# EAGLE design led_board_RGB-3hole (EAGLE 8.3.1)
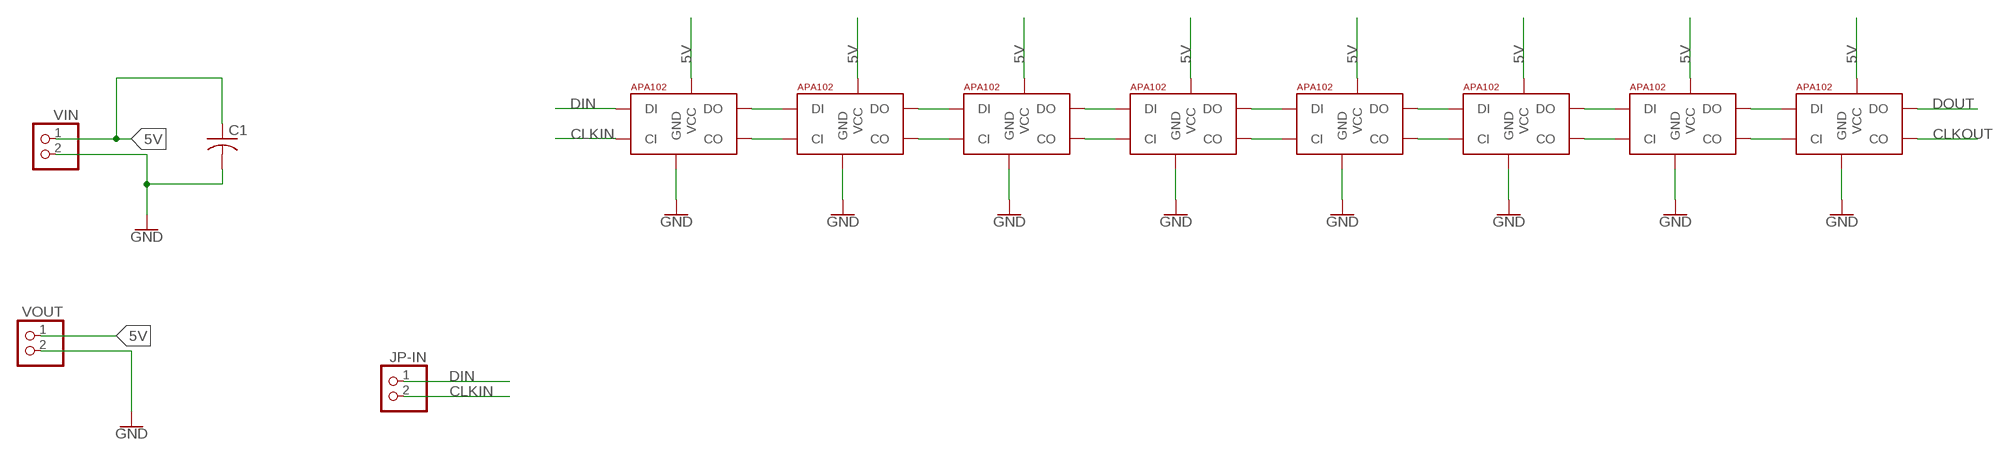
[diagram p0: schematic, sheet 1]

## Parts
C1  C-US025-030X050  [C025-030X050]
ED4  APA1025050  [APA102_5050]
JP-IN  PINHD-1X2  [1X02]
LED0  APA1025050  [APA102_5050]
LED1  APA1025050  [APA102_5050]
LED2  APA1025050  [APA102_5050]
LED3  APA1025050  [APA102_5050]
LED5  APA1025050  [APA102_5050]
LED6  APA1025050  [APA102_5050]
LED7  APA1025050  [APA102_5050]
VIN  PINHD-1X2  [1X02]
VOUT  PINHD-1X2  [1X02]

## Nets
5V: C1.1 ED4.1(VCC) LED0.1(VCC) LED1.1(VCC) LED2.1(VCC) LED3.1(VCC) LED5.1(VCC) LED6.1(VCC) LED7.1(VCC) VIN.1 VOUT.1
CLKIN: JP-IN.2 LED0.5(CI)
CLKOUT: LED7.2(CO)
DIN: JP-IN.1 LED0.4(DI)
DOUT: LED7.3(DO)
GND: C1.2 ED4.6(GND) LED0.6(GND) LED1.6(GND) LED2.6(GND) LED3.6(GND) LED5.6(GND) LED6.6(GND) LED7.6(GND) VIN.2 VOUT.2
N$9: LED0.3(DO) LED1.4(DI)
N$10: LED0.2(CO) LED1.5(CI)
N$11: LED1.3(DO) LED2.4(DI)
N$12: LED1.2(CO) LED2.5(CI)
N$13: LED2.3(DO) LED3.4(DI)
N$14: LED2.2(CO) LED3.5(CI)
N$15: ED4.4(DI) LED3.3(DO)
N$16: ED4.5(CI) LED3.2(CO)
N$17: ED4.3(DO) LED5.4(DI)
N$18: ED4.2(CO) LED5.5(CI)
N$19: LED5.3(DO) LED6.4(DI)
N$20: LED5.2(CO) LED6.5(CI)
N$21: LED6.3(DO) LED7.4(DI)
N$22: LED6.2(CO) LED7.5(CI)

## Library data of the parts
C1 = adafruit:C-US: CAPACITOR, American symbol
ED4 LED0 LED1-LED3 LED5-LED7 = jos-ph:APA102: APA102C 5050 RGB LED -- Adafruit DotStar Single LED Pixel Product Page: https://www.adafruit.com/products/2343 Datasheet: https://cdn-shop.adafruit.com/product-files/2343/APA102C.pdf
JP-IN VIN VOUT = pinhead:PINHD-1X2: PIN HEADER

## Board
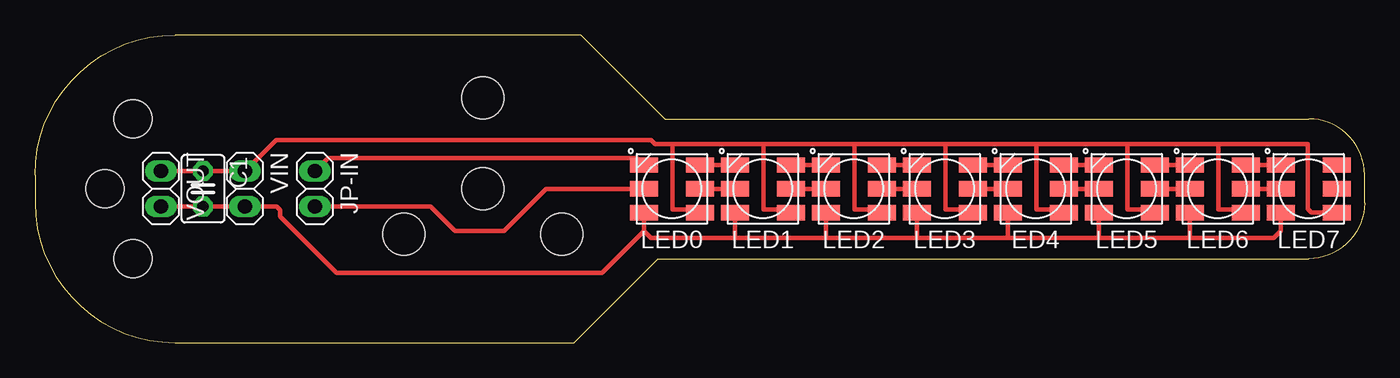
[diagram p1: board, top side]

Size 95 x 22 mm. Coordinates in mm from the lower left corner, seen from the top.
Outline: 10,0 38.5,0 44,5.5 44.5,6 45,6 91,6 arc90 95,10 95,12 arc90 91,16 45.5,16 45,16 44.5,16.5 39,22 10,22 arc90 0,12 0,10 arc90 10,0
Copper layers (1*16): Top 0.035mm / dielectric 1.5mm / Bottom 0.035mm
Design rules "OthermillDRC_1_64_v2": minimum track width 16mil, minimum drill 31mil, track to track 0.39878125mm, track to pad 0.39878125mm, pad to pad 0.39878125mm, via to via 0.39878125mm, smd to smd 0mil, copper to edge 0mil, drill to drill 1mil, minimum pad ring 0mil, minimum via ring 15mil, stop-mask expansion 1mil, vias tented up to drill 30mil, thermal gap 10mil
Holes 3 mm at 32,11 32,17.5 37.63,7.75 26.37,7.75
Holes 2.75 mm at 5,11 7,6 7,16

### Footprints (pad centres in the part's own frame; a part is rotated, then mirrored left to right if it is on the bottom)
C025-030X050 = drill 0.813 pad 1.422 octagon: 1 -1.27,0; 2 1.27,0
APA102_5050 = smd 2 x 1.1: 1 2,-1.7; 2 2,0; 3 2,1.7; 4 -2,1.7; 5 -2,0; 6 -2,-1.7
1X02 = drill 1.016 long: 1 -1.27,0; 2 1.27,0

### Placement (x,y rotation side)
C1  12,11 270 top
ED4  71.5,11 0 top
JP-IN  20,11 270 top
LED0  45.5,11 0 top
LED1  52,11 0 top
LED2  58.5,11 0 top
LED3  65,11 0 top
LED5  78,11 0 top
LED6  84.5,11 0 top
LED7  91,11 0 top
VIN  15,11 270 top
VOUT  9,11 270 top

### Tracks (layer width: path | path; a pad name or v marks a point on that pad's centre or on a via)
5V
  Top 0.305: 45.55,14.2 45.55,9.5 47.3,9.5 LED0.1 | 52.05,14.2 45.55,14.2 | 58.55,14.2 52.05,14.2 | 65.05,14.2 58.55,14.2 | 71.55,14.2 65.05,14.2 | 78.05,14.2 71.55,14.2 | 84.55,14.2 78.05,14.2 | 84.55,14.2 90.95,14.2 90.95,9.55 91.2,9.3 LED7.1 | 52.05,14.2 52.05,9.5 53.8,9.5 LED1.1 | 58.55,14.2 58.55,9.5 60.3,9.5 LED2.1 | 65.05,14.2 65.05,9.5 66.8,9.5 LED3.1 | 71.55,14.2 71.55,9.5 73.3,9.5 ED4.1 | 78.05,14.2 78.05,9.5 79.8,9.5 LED5.1 | 84.55,14.2 84.55,9.5 86.3,9.5 LED6.1 | VOUT.1 C1.1 VIN.1 17.23,14.5 44,14.5 44.3,14.2 45.55,14.2
CLKIN
  Top 0.305: JP-IN.2 28.27,9.73 30,8 33.5,8 36.5,11 LED0.5
DIN
  Top 0.305: JP-IN.1 20.93,13.2 43,13.2 LED0.4
GND
  Top 0.305: 43.5,8 LED0.6 | 43.5,8 44,7.5 50.04,7.5 | 75.92,7.5 82.46,7.5 | 69.55,7.5 75.92,7.5 | 63.04,7.5 69.55,7.5 | 56.47,7.5 63.04,7.5 | 50.04,7.5 56.47,7.5 | 82.46,7.5 88.5,7.5 89,8 LED7.6 | LED6.6 82.5,7.54 82.46,7.5 | LED5.6 76,7.58 75.92,7.5 | ED4.6 69.5,7.55 69.55,7.5 | LED3.6 63,7.54 63.04,7.5 | LED2.6 56.5,7.53 56.47,7.5 | LED1.6 50,7.54 50.04,7.5 | 43.5,8 40.5,5 21.55,5 17.53,9.02 17.53,9.47 17.27,9.73 VIN.2 C1.2 VOUT.2
N$9
  Top 0.305: LED0.3 LED1.4
N$10
  Top 0.305: LED0.2 LED1.5
N$11
  Top 0.305: LED1.3 LED2.4
N$12
  Top 0.305: LED2.5 LED1.2
N$13
  Top 0.305: LED2.3 LED3.4
N$14
  Top 0.305: LED3.5 LED2.2
N$15
  Top 0.305: LED3.3 ED4.4
N$16
  Top 0.305: ED4.5 LED3.2
N$17
  Top 0.305: ED4.3 LED5.4
N$18
  Top 0.305: LED5.5 ED4.2
N$19
  Top 0.305: LED5.3 LED6.4
N$20
  Top 0.305: LED6.5 LED5.2
N$21
  Top 0.305: LED6.3 LED7.4
N$22
  Top 0.305: LED6.2 LED7.5